# Altium project LM_HTR_001.PrjPcb
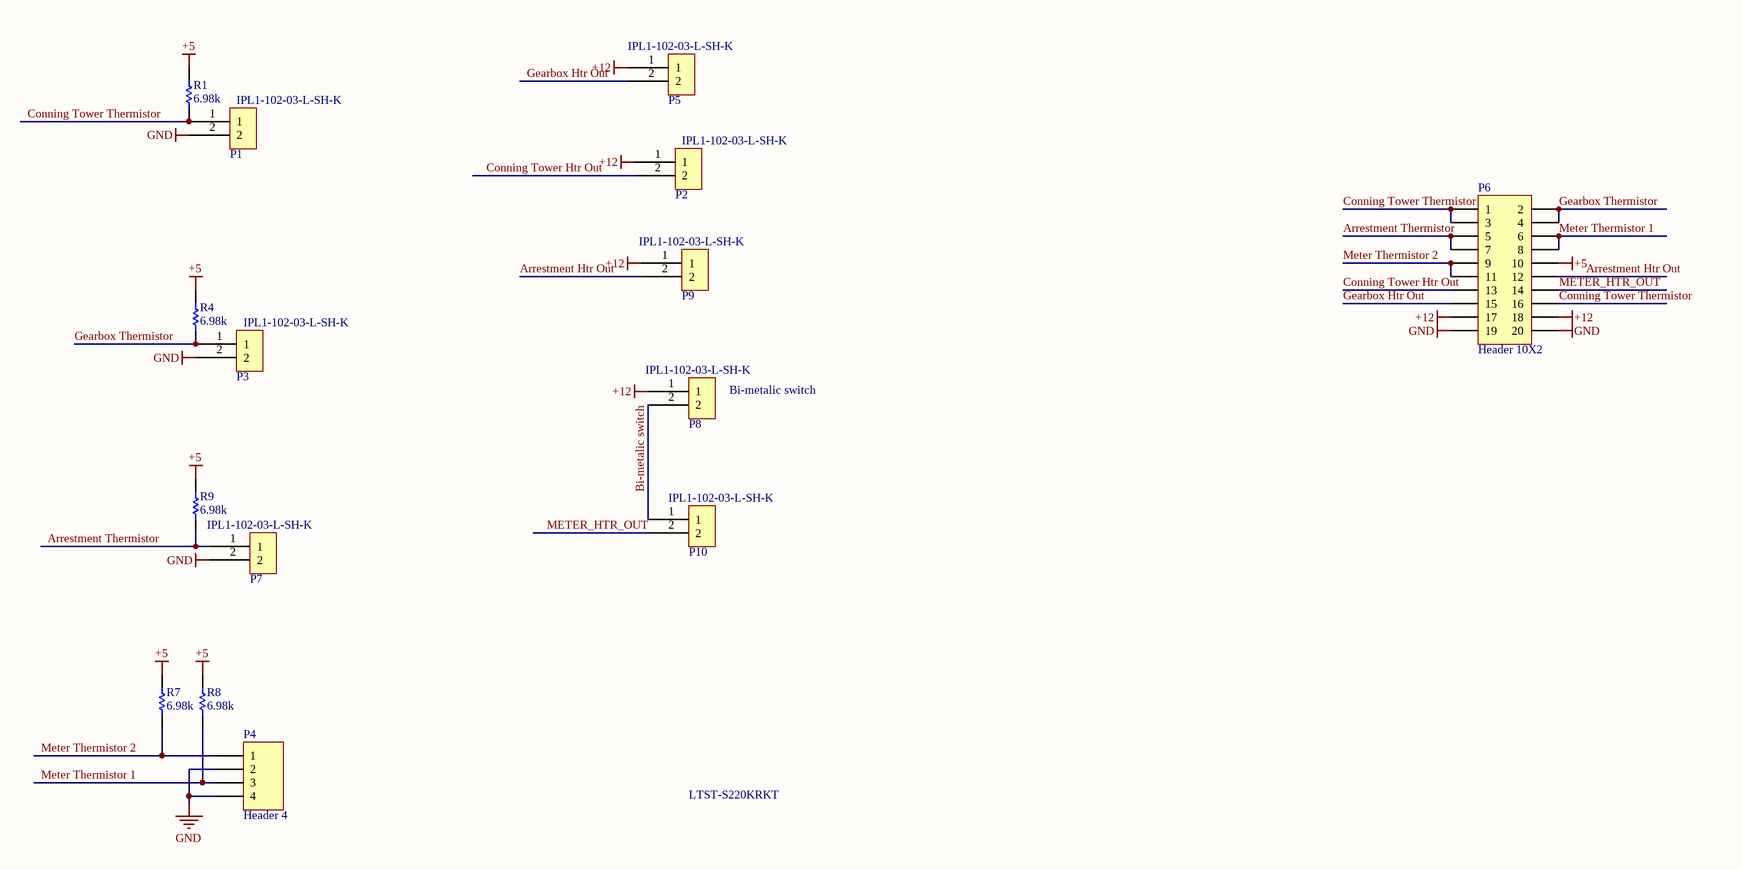
[diagram p0: LM_HTR_001.SchDoc]
1 sheet, 15 parts. Net scope: global (net labels, ports and power ports of the same name join across sheets).
Board file: LM_HTR_001.PcbDoc

## Sheet LM_HTR_001.SchDoc: Land Meter Heater Assembly
size Tabloid; DocumentNumber: LM_HTR_001; Revision: -; SheetNumber: 1; SheetTotal: 1

### Parts
P1  IPL1-102-03-L-SH-K  [IPL1-102-03-L-SH-K]
P2  IPL1-102-03-L-SH-K  [IPL1-102-03-L-SH-K]
P3  IPL1-102-03-L-SH-K  [IPL1-102-03-L-SH-K]
P4  Header 4  [IPL1-104-01-L-S-K]
P5  IPL1-102-03-L-SH-K  [IPL1-102-03-L-SH-K]
P6  Header 10X2  [IPL1-110-01-L-D-RE1-K]
P7  IPL1-102-03-L-SH-K  [IPL1-102-01-L-S-RE1-K]
P8  IPL1-102-03-L-SH-K  [IPL1-102-03-L-SH-K]
P9  IPL1-102-03-L-SH-K  [IPL1-102-03-L-SH-K]
P10  IPL1-102-03-L-SH-K  [IPL1-102-03-L-SH-K]
R1  Resistance (Ohms): 6.98k  [RESC0805(2012)_N]  (hidden comment: 6K98 1% 0805(2012))
R4  Resistance (Ohms): 6.98k  [RESC0805(2012)_N]  (hidden comment: 6K98 1% 0805(2012))
R7  Resistance (Ohms): 6.98k  [RESC0805(2012)_N]  (hidden comment: 6K98 1% 0805(2012))
R8  Resistance (Ohms): 6.98k  [RESC0805(2012)_N]  (hidden comment: 6K98 1% 0805(2012))
R9  Resistance (Ohms): 6.98k  [RESC0805(2012)_N]  (hidden comment: 6K98 1% 0805(2012))

### Nets
+5: P6.10 R1.2 R4.2 R7.1 R8.2 R9.1
+12: P2.1 P5.1 P6.17 P6.18 P8.1 P9.1
GND: P1.2 P3.2 P4.2 P4.4 P6.19 P6.20 P7.2
Arrestment Htr Out: P6.12 P9.2
Arrestment Thermistor: P6.5 P6.7 P7.1 R9.2
Bi-metalic switch: P8.2 P10.1
Conning Tower Htr Out: P2.2 P6.13
Conning Tower Thermistor: P1.1 P6.1 P6.3 P6.16 R1.1
Gearbox Htr Out: P5.2 P6.15
Gearbox Thermistor: P3.1 P6.2 P6.4 R4.1
Meter Thermistor 1: P4.3 P6.6 P6.8 R8.1
Meter Thermistor 2: P4.1 P6.9 P6.11 R7.2
METER_HTR_OUT: P6.14 P10.2

### Notes on the sheet
- (near P8) Bi-metalic switch
- LTST-S220KRKT
- Title
- Size:
- Date:
- Tabloid
- Number:
- Time:
- Revision:
- Sheet
- of
- ZLS Corporation
- 7801 North Lamar Blvd.
- Suite E-184
- Austin, Texas 78752  USA
- (512) 453-0288
- File:

### Library data of the parts
P1-P3 P5 P7-P10 = IPL1-102-03-L-SH-K: Manufacturer: Samtec; Number of Contacts: 2; Gender: Male; Pitch: 2.54mm; Supplier 1: Avnet; Supplier Part Number 1: IPL1-102-03-L-SH-K; Manufacturer Part Number: IPL1-102-03-L-SH-K; Stock 1: 0; Mount: Surface Mount; Case/Package: SMD/SMT; Packaging: Bulk; Termination: Solder; Orientation: Right Angle; Radiation Hardening: No; ComponentLink1URL: http://www.samtec.com/documents/webfiles/pdf/ipl1.pdf; ComponentLink1Description: http://www.samtec.com/documents/webfiles/pdf/ipl1.pdf
P4 = Header 4: Header, 4-Pin; LatestRevisionDate: 17-Jul-2002; LatestRevisionNote: Re-released for DXP Platform.; Publisher: Altium Limited
P6 = Header 10X2: Header, 10-Pin, Dual row; LatestRevisionDate: 17-Jul-2002; LatestRevisionNote: Re-released for DXP Platform.; Publisher: Altium Limited
R1 R4 R7-R9 = CMP-1013-00606-1: 6K98 0.125W 1% 0805 (2012 Metric)  SMD; Manufacturer: Vishay Dale; Manufacturer Part Number: CRCW08056K98FKEA; Power (Watts): 0.125W, 1/8W; Temperature Coefficient: ±100ppm/°C; Supplier 1: Digi-Key; Supplier Part Number 1: 541-6.98KCCT-ND; RoHS: RoHS Compliant; Category: Resistors; Stock 1: 34245; Pricing 1: 1=0.1, 10=0.044, 100=0.0178, 1000=0.00802, 2500=0.00696 (USD); Packaging: Cut Tape (CT); Part Status: Active; Tolerance: ±1%; Composition: Thick Film; Features: Automotive AEC-Q200; Operating Temperature: -55°C ~ 155°C; Package / Case: 0805 (2012 Metric); Supplier Device Package: 0805; Size / Dimension: 0.079" L x 0.049" W (2.00mm x 1.25mm); Height - Seated (Max): 0.020" (0.50mm); Failure Rate: -; ComponentLink1URL: http://www.vishay.com/docs/20035/dcrcwe3.pdf; ComponentLink1Description: http://www.vishay.com/docs/20035/dcrcwe3.pdf